# EAGLE design MotorController (EAGLE 7.4.0)
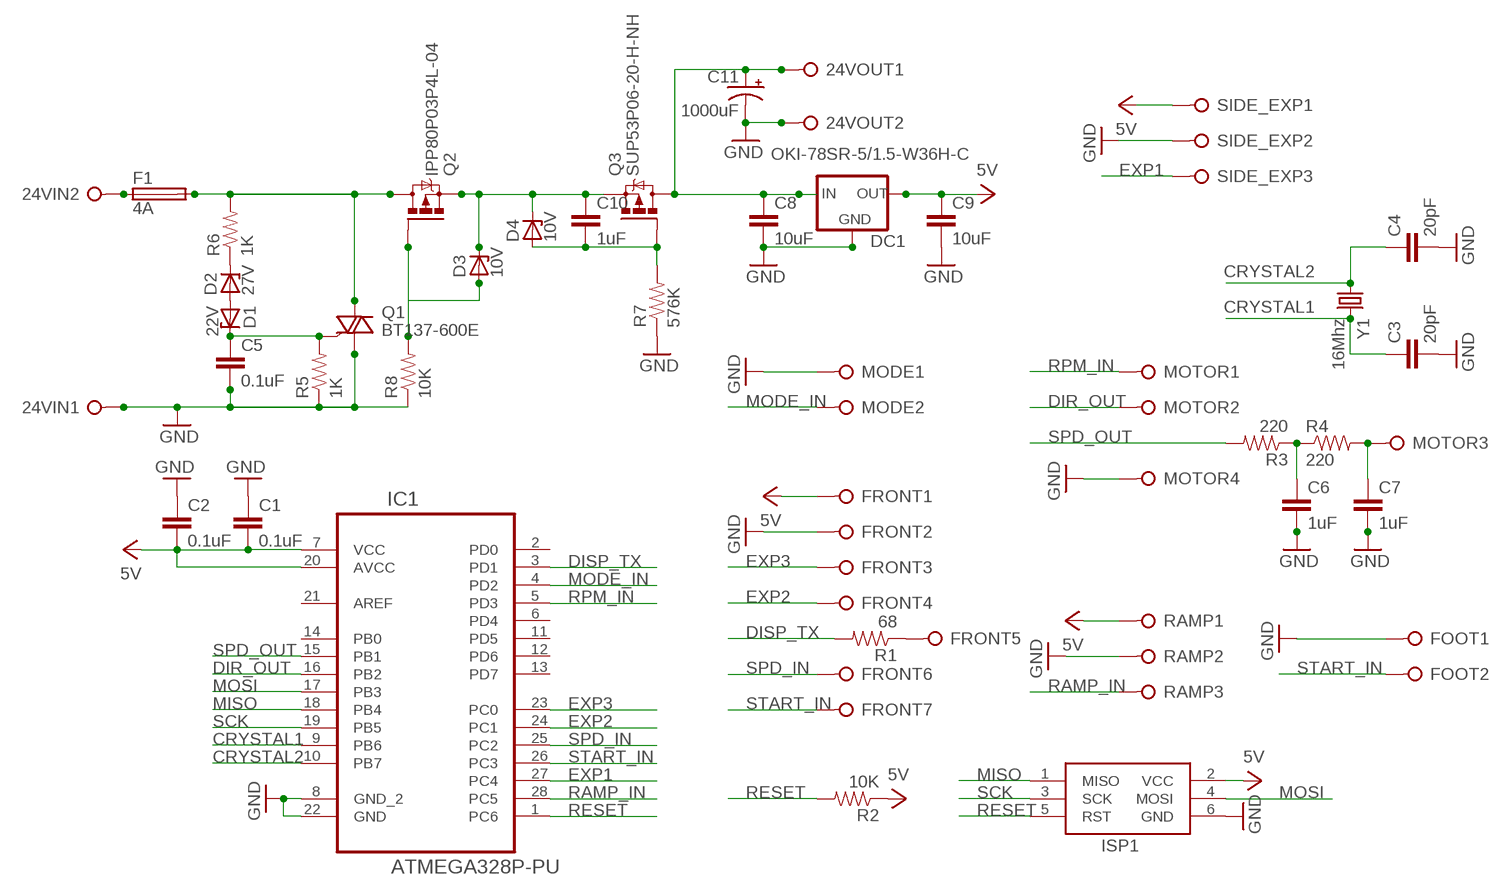
[diagram p0: schematic, sheet 1]

## Parts
24VIN  PINHD-1X2BIG  [1X02-BIG]
24VOUT  PINHD-1X2BIG  [1X02-BIG]
C1  0.1uF  CAPACITOR-2.5MM  [CAPACITOR-2.5MM]
C2  0.1uF  CAPACITOR-2.5MM  [CAPACITOR-2.5MM]
C3  20pF  CAPACITOR-2.5MM  [CAPACITOR-2.5MM]
C4  20pF  CAPACITOR-2.5MM  [CAPACITOR-2.5MM]
C5  0.1uF  CAPACITOR-2.5MM  [CAPACITOR-2.5MM]
C6  1uF  CAPACITOR-2.5MM  [CAPACITOR-2.5MM]
C7  1uF  CAPACITOR-2.5MM  [CAPACITOR-2.5MM]
C8  10uF  CAPACITOR-5MM  [CAPACITOR-5MM]
C9  10uF  CAPACITOR-5MM  [CAPACITOR-5MM]
C10  1uF  CAPACITOR-2.5MM  [CAPACITOR-2.5MM]
C11  1000uF  CAP-POL-25-14  [CAP-POL-25-14]
D1  22V  ZENER-7.5  [ZDIO-7.5]
D2  27V  ZENER-7.5  [ZDIO-7.5]
D3  10V  ZENER-7.5  [ZDIO-7.5]
D4  10V  ZENER-7.5  [ZDIO-7.5]
DC1  OKI-78SR-5/1.5-W36H-C  DC-CONV  [DC-CONV]
F1  4A  FUSE  [FUSE_HOLDER_5X20MM]
FOOT  PINHD-1X2BIG  [1X02-BIG]
FRONT  PINHD-1X7BIG  [1X07-BIG]
IC1  ATMEGA328P-PU  [DIP28]
ISP1  ICSP-HEADER-6  [ICSP-HEADER]
MODE  PINHD-1X2BIG  [1X02-BIG]
MOTOR  PINHD-1X4BIG  [1X04-BIG]
Q1  BT137-600E  TRIAC-H-NH  [TO220BH-NO-HOLE]
Q2  IPP80P03P4L-04  SUP53P06-20-H-NH  [TO220BH-NO-HOLE]
Q3  SUP53P06-20-H-NH  [TO220BH-NO-HOLE]
R1  68  RESISTOR-7.5MM  [AXIAL-7.5MM]
R2  10K  RESISTOR-7.5MM  [AXIAL-7.5MM]
R3  220  RESISTOR-7.5MM  [AXIAL-7.5MM]
R4  220  RESISTOR-7.5MM  [AXIAL-7.5MM]
R5  1K  RESISTOR-7.5MM  [AXIAL-7.5MM]
R6  1K  RESISTOR-7.5MM  [AXIAL-7.5MM]
R7  576K  RESISTOR-7.5MM  [AXIAL-7.5MM]
R8  10K  RESISTOR-7.5MM  [AXIAL-7.5MM]
RAMP  PINHD-1X3BIG  [1X03-BIG]
SIDE_EXP  PINHD-1X3BIG  [1X03-BIG]
Y1  16Mhz  CRYSTAL-V  [CRYSTAL-V]

## Nets
24V [power]: F1.2 Q1.P2(A2) Q2.P2(D) R6.P$2
24V-PROTECTED [power]: 24VOUT.1 C8.1 C11.+ DC1.P1(IN) Q3.P2(D)
CRYSTAL1: C3.1 IC1.9(PB6) Y1.2
CRYSTAL2: C4.1 IC1.10(PB7) Y1.1
DIR_OUT: IC1.16(PB2) MOTOR.2
DISP_TX: IC1.3(PD1) R1.P$2
EXP1: IC1.27(PC4) SIDE_EXP.3
EXP2: FRONT.4 IC1.24(PC1)
EXP3: FRONT.3 IC1.23(PC0)
GND: 24VIN.1 24VOUT.2 C1.1 C2.1 C3.2 C4.2 C5.2 C6.2 C7.2 C8.2 C9.2 C11.- DC1.P2(GND) FOOT.1 FRONT.2 IC1.8(GND_2) IC1.22(GND) ISP1.6(GND) MODE.1 MOTOR.4 Q1.P1(A1) R5.P$1 R7.P$1 R8.P$1 RAMP.2 SIDE_EXP.2
MISO: IC1.18(PB4) ISP1.1(MISO)
MODE_IN: IC1.4(PD2) MODE.2
MOSI: IC1.17(PB3) ISP1.4(MOSI)
N$1: C6.1 R3.P$1 R4.P$1
N$3: 24VIN.2 F1.1
N$4: D3.A Q2.P1(G) R8.P$2
N$5: D2.C R6.P$1
N$6: D1.A D2.A
N$7: C5.1 D1.C Q1.P3(G) R5.P$2
N$8: FRONT.5 R1.P$1
N$9 [power]: C10.1 D3.C D4.C Q2.P3(S) Q3.P3(S)
N$10: C7.1 MOTOR.3 R4.P$2
N$11: C10.2 D4.A Q3.P1(G) R7.P$2
RAMP_IN: IC1.28(PC5) RAMP.3
RESET: IC1.1(PC6) ISP1.5(RST) R2.P$2
RPM_IN: IC1.5(PD3) MOTOR.1
SCK: IC1.19(PB5) ISP1.3(SCK)
SPD_IN: FRONT.6 IC1.25(PC2)
SPD_OUT: IC1.15(PB1) R3.P$2
START_IN: FOOT.2 FRONT.7 IC1.26(PC3)
VCC: C1.2 C2.2 C9.1 DC1.P3(OUT) FRONT.1 IC1.7(VCC) IC1.20(AVCC) ISP1.2(VCC) R2.P$1 RAMP.1 SIDE_EXP.1 ; supply symbol labelled 5V
Unconnected: IC1.2(PD0) IC1.6(PD4) IC1.11(PD5) IC1.12(PD6) IC1.13(PD7) IC1.14(PB0) IC1.21(AREF)

## Library data of the parts
24VIN 24VOUT FOOT MODE = SaintGimp:PINHD-1X2
C1-C10 = SaintGimp:CAPACITOR-*: Ceramic Capacitor
C11 = SaintGimp:CAP-POL: Polarized Capacitor
D1-D4 = SaintGimp:ZENER: Zener Diode
DC1 = SaintGimp:DC-CONV: DC-DC Converter
F1 = SaintGimp:FUSE
FRONT = SaintGimp:PINHD-1X7
IC1 = SaintGimp:ATMEGA328P-PU: 8-bit Microcontroller with In-System Programmable Flash; MPN: ATMEGA328P-PU; OC_FARNELL: 1715487; OC_NEWARK: 15R0268; PACKAGE: PDIP-28; SUPPLIER: Atmel
ISP1 = SaintGimp:ICSP-HEADER: ICSP HEADER Standard 6 pin header for ICSP programming
MOTOR = SaintGimp:PINHD-1X4
Q1 = SaintGimp:TRIAC: TRIAC
Q2 Q3 = SaintGimp:SUP53P06-20: P-Channel MOSFET
R1-R8 = SaintGimp:RESISTOR-*
RAMP SIDE_EXP = SaintGimp:PINHD-1X3: PIN HEADER
Y1 = SaintGimp:CRYSTAL: Crystal Oscillator

## Net classes
1 power: width 0.381 mm

## Board
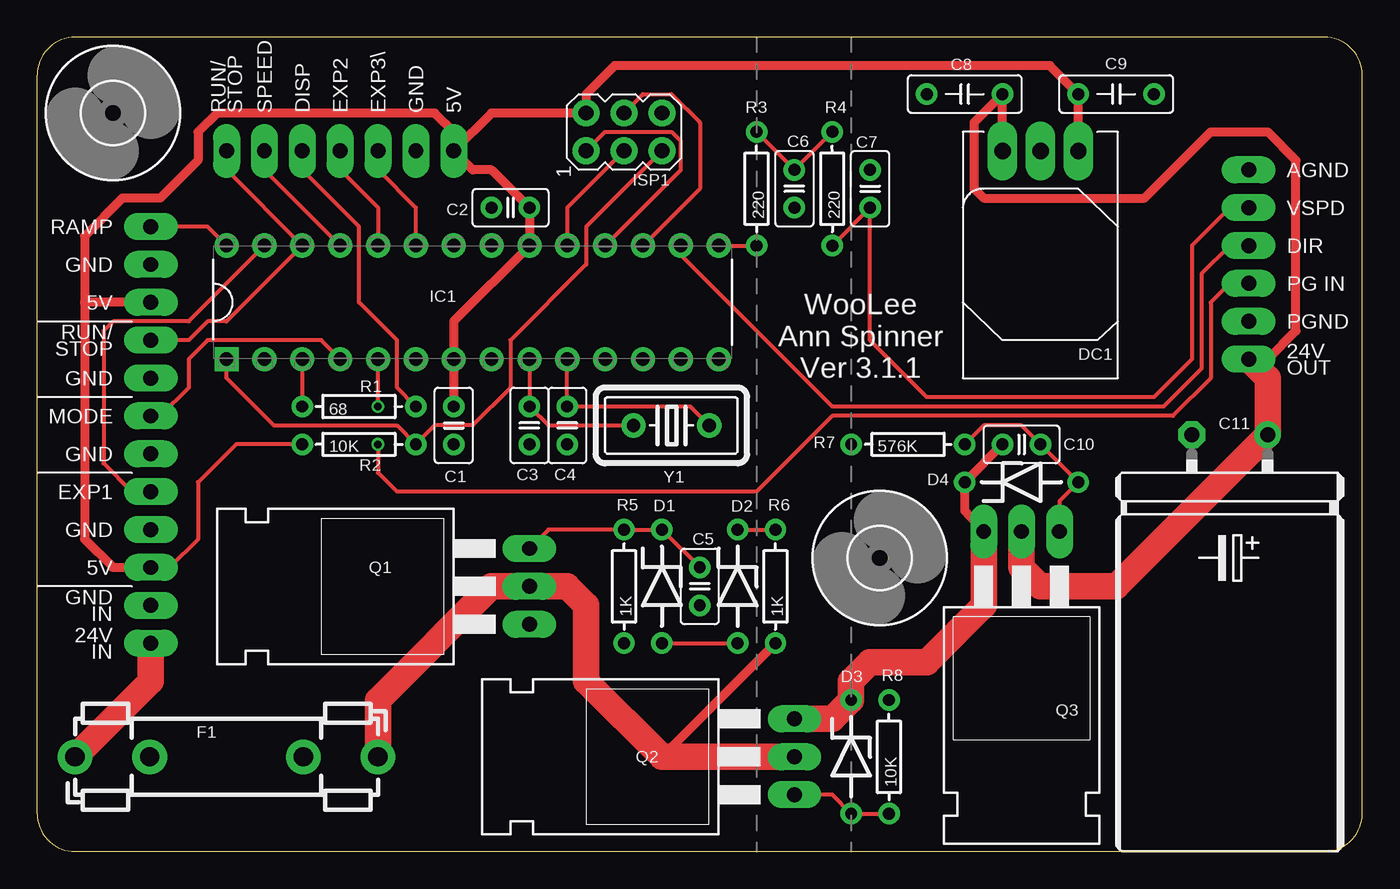
[diagram p1: board, top side]
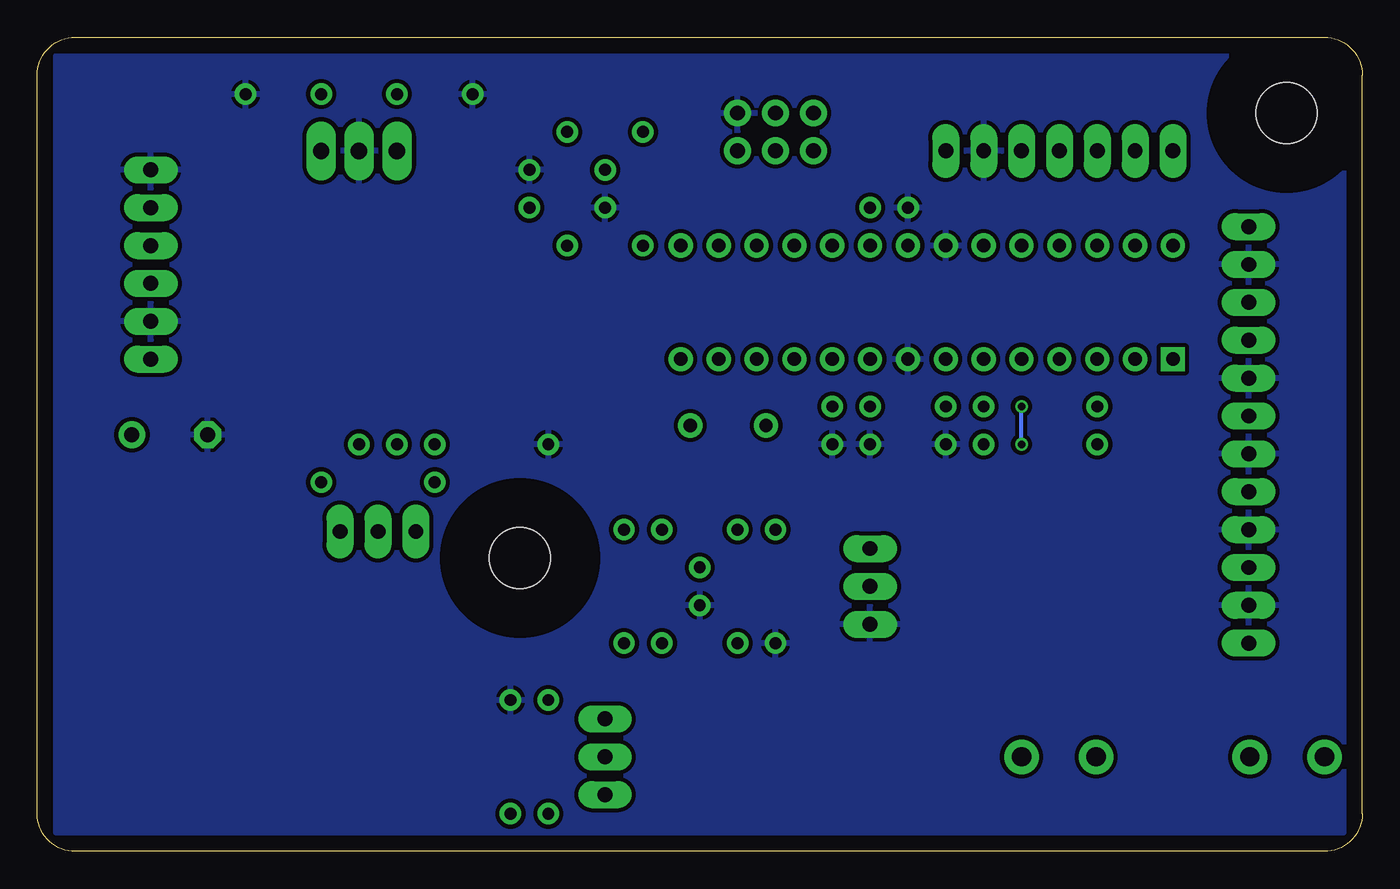
[diagram p2: board, bottom side, seen from below]

Size 88.9 x 54.61 mm. Coordinates in mm from the lower left corner, seen from the top.
Outline: 0,2.54 arc90 2.54,0 86.36,0 arc90 88.9,2.54 88.9,52.07 arc90 86.36,54.61 2.54,54.61 arc90 0,52.07 0,2.54
Copper layers (1*16): Top 0.0356mm / dielectric 1.5011mm / Bottom 0.0356mm
Design rules "Saintgimp-OSHPark": minimum track width 10mil, minimum drill 13mil, track to track 6mil, track to pad 6mil, pad to pad 6mil, via to via 6mil, smd to smd 6mil, copper to edge 15mil, drill to drill 6mil, minimum pad ring 12mil, minimum via ring 7mil, stop-mask expansion 2mil, vias tented up to drill 20mil, thermal gap 10mil

### Footprints (pad centres in the part's own frame; a part is rotated, then mirrored left to right if it is on the bottom)
1X02-BIG = drill 1 long: 1 -1.27,0; 2 1.27,0
CAPACITOR-2.5MM = drill 0.8: 1 -1.27,0; 2 1.27,0
CAPACITOR-5MM = drill 0.8: 1 -2.54,0; 2 2.54,0
CAP-POL-25-14 = drill 1: + -17.78,2.54 | drill 1 octagon: - -17.78,-2.54
ZDIO-7.5 = drill 0.8: A 3.81,0; C -3.81,0
DC-CONV = drill 1.1 long: P1 2.54,-7.62; P2 0,-7.62; P3 -2.54,-7.62
FUSE_HOLDER_5X20MM = drill 1.3: 1 -10.16,0; 2 10.16,0; 3 -5.156,0; 5 5.156,0
1X07-BIG = drill 1 long: 1 -7.62,0; 2 -5.08,0; 3 -2.54,0; 4 0,0; 5 2.54,0; 6 5.08,0; 7 7.62,0
DIP28 = drill 0.9 square: 1 -7.62,33.02 | drill 0.9: 2 -7.62,30.48; 3 -7.62,27.94; 4 -7.62,25.4; 5 -7.62,22.86; 6 -7.62,20.32; 7 -7.62,17.78; 8 -7.62,15.24; 9 -7.62,12.7; 10 -7.62,10.16; 11 -7.62,7.62; 12 -7.62,5.08; 13 -7.62,2.54; 14 -7.62,0; 15 0,0; 16 0,2.54; 17 0,5.08; 18 0,7.62; 19 0,10.16; 20 0,12.7; 21 0,15.24; 22 0,17.78; 23 0,20.32; 24 0,22.86; 25 0,25.4; 26 0,27.94; 27 0,30.48; 28 0,33.02
ICSP-HEADER = drill 1: 1 -1.27,2.54; 2 1.27,2.54; 3 -1.27,0; 4 1.27,0; 5 -1.27,-2.54; 6 1.27,-2.54
1X04-BIG = drill 1 long: 1 -3.81,0; 2 -1.27,0; 3 1.27,0; 4 3.81,0
TO220BH-NO-HOLE = drill 1 long: P1 -2.54,-6.35; P2 0,-6.35; P3 2.54,-6.35
AXIAL-7.5MM = drill 0.8: P$1 -3.81,0; P$2 3.81,0
1X03-BIG = drill 1 long: 1 -2.54,0; 2 0,0; 3 2.54,0
4,1 = hole 4.1: 0,0
CRYSTAL-V = drill 0.9: 1 -2.54,0; 2 2.54,0

### Placement (x,y rotation side)
24VIN  7.62,15.24 270 top
24VOUT  81.28,34.29 90 top
C1  27.94,28.57 90 top
C2  31.75,43.18 0 top
C3  33.02,28.57 270 top
C4  35.56,28.57 270 top
C5  44.45,17.78 270 top
C6  50.8,44.45 270 top
C7  55.88,44.45 90 top
C8  62.23,50.8 180 top
C9  72.39,50.8 0 top
C10  66.04,27.3 0 top
C11  80.01,10.16 270 top
D1  41.91,17.78 270 top
D2  46.99,17.78 270 top
D3  54.61,6.35 270 top
D4  66.04,24.77 0 top
DC1  67.31,39.37 180 top
F1  12.7,6.35 0 top
FOOT  7.62,33.02 90 top
FRONT  20.32,46.99 180 top
IC1  45.72,40.64 90 top
ISP1  39.37,48.26 90 top
MODE  7.62,27.94 90 top
MOTOR  81.28,41.91 90 top
Q1  26.67,17.78 90 top
Q2  44.45,6.35 90 top
Q3  66.04,15.11 180 top
R1  21.59,29.84 180 top
R2  21.59,27.3 0 top
R3  48.26,44.45 270 top
R4  53.34,44.45 270 top
R5  39.37,17.78 90 top
R6  49.53,17.78 270 top
R7  58.42,27.3 0 top
R8  57.15,6.35 270 top
RAMP  7.62,39.37 90 top
SIDE_EXP  7.62,21.59 90 top
U$2  [4,1]  5.08,49.53 0 top
U$4  [4,1]  56.52,19.68 0 top
Y1  42.55,28.57 180 top

### Tracks (layer width: path | path; a pad name or v marks a point on that pad's centre or on a via)
24V
  Top 0.61: R6.P$2 41.91,6.35
  Top 1.778: Q2.P2 41.91,6.35 36.83,11.43 36.83,16.51 35.56,17.78 Q1.P2 30.48,17.78 22.86,10.16 F1.2
24V-PROTECTED
  Top 0.61: 24VOUT.1 82.55,33.02 84.45,34.92 84.45,46.35 82.55,48.26 78.74,48.26 74.3,43.81 63.5,43.81 62.87,44.45 62.87,48.9 C8.1 DC1.P1
  Top 1.778: Q3.P2 66.04,19.05 67.31,17.78 72.39,17.78 C11.+ 82.55,31.75 24VOUT.1
CRYSTAL1
  Top 0.254: Y1.2 34.29,28.57 C3.1 IC1.9
CRYSTAL2
  Top 0.254: Y1.1 43.81,29.84 C4.1 IC1.10
DIR_OUT
  Top 0.254: MOTOR.2 80.01,40.64 78.11,38.73 78.11,32.38 75.56,29.84 53.34,29.84 43.18,40.01 IC1.16
DISP_TX
  Top 0.254: IC1.3 R1.P$2
EXP1
  Top 0.254: IC1.27 10.16,35.56 5.08,35.56 4.45,34.92 4.45,26.04 6.35,24.13 SIDE_EXP.3
EXP2
  Top 0.254: FRONT.4 20.32,45.72 22.86,43.18 IC1.24
EXP3
  Top 0.254: FRONT.3 22.86,45.72 25.4,43.18 IC1.23
GND
  pour Bottom (isolate 0.279): 1.27,53.34 1.27,1.27 87.63,1.27 87.63,53.34
MISO
  Top 0.254: ISP1.1 38.1,48.26 42.55,48.26 43.18,47.62 43.18,45.72 IC1.18
MODE_IN
  Top 0.254: IC1.4 19.05,34.29 11.43,34.29 10.16,33.02 10.16,31.11 8.26,29.21 MODE.2
MOSI
  Top 0.254: ISP1.4 40.64,50.8 42.55,50.8 44.45,48.9 44.45,44.45 IC1.17
N$1
  Top 0.254: R3.P$1 C6.1 R4.P$1
N$3
  Top 1.778: F1.1 7.62,11.43 24VIN.2
N$4
  Top 0.254: R8.P$2 D3.A 53.34,3.81 Q2.P1
N$5
  Top 0.254: D2.C R6.P$1
N$6
  Top 0.254: D1.A D2.A
N$7
  Top 0.254: C5.1 D1.C R5.P$2 34.29,21.59 Q1.P3
N$8
  Top 0.254: R1.P$1 24.13,31.11 24.13,34.29 21.59,36.83 21.59,41.91 17.78,45.72 FRONT.5
N$9
  Top 0.61: Q3.P3 62.23,22.86 D4.C C10.1
  Top 1.778: Q3.P3 63.5,16.51 59.69,12.7 55.88,12.7 54.61,11.43 D3.C 53.34,8.89 Q2.P3
N$10
  Top 0.254: R4.P$2 C7.1 55.88,34.29 59.69,30.48 74.93,30.48 77.47,33.02 77.47,40.64 80.01,43.18 MOTOR.3
N$11
  Top 0.254: Q3.P1 68.58,23.5 D4.A C10.2 66.04,28.57 63.5,28.57 R7.P$2
RAMP_IN
  Top 0.254: IC1.28 11.43,41.91 RAMP.3
RESET
  Top 0.254: IC1.1 12.7,31.75 15.88,28.57 24.13,28.57 R2.P$2 26.67,28.57 29.21,28.57 31.75,31.11 31.75,34.29 36.83,39.37 36.83,41.91 40.64,45.72 ISP1.5
RPM_IN  (via drill 0.5)
  Top 0.254: MOTOR.1 80.01,38.1 78.74,36.83 78.74,31.75 76.2,29.21 53.34,29.21 48.26,24.13 24.13,24.13 22.86,25.4 v22.86,27.3 | v22.86,29.84 IC1.5
  Bottom 0.254: v22.86,27.3 v22.86,29.84
SCK
  Top 0.254: ISP1.3 35.56,43.18 IC1.19
SPD_IN
  Top 0.254: FRONT.6 15.24,45.72 IC1.25
SPD_OUT
  Top 0.254: IC1.15 R3.P$2
START_IN
  Top 0.254: FOOT.2 10.16,34.29 11.43,35.56 12.7,35.56 IC1.26 12.7,45.72 FRONT.7
VCC
  Top 0.254: SIDE_EXP.1 8.89,19.05 10.79,20.95 10.79,24.77 13.34,27.3 R2.P$1
  Top 0.61: C1.2 IC1.7 27.94,35.56 IC1.20 C2.2 30.48,45.72 29.21,45.72 FRONT.1 | 3.17,36.83 3.17,41.27 5.71,43.81 8.26,43.81 10.79,46.35 10.79,48.26 12.06,49.53 26.67,49.53 27.94,48.26 FRONT.1 | 3.17,36.83 3.17,20.95 5.08,19.05 SIDE_EXP.1 | RAMP.1 3.17,36.83 | FRONT.1 30.48,49.53 ISP1.2 36.83,50.8 38.73,52.7 67.94,52.7 C9.1 DC1.P3

### Text on the board
_tsilk: RUN/ / STOP | SPEED | DISP | EXP2 | EXP3\ | GND | 5V | AGND | VSPD | RAMP | DIR | GND | PG IN | 5V | PGND | RUN/ / STOP | 24V / OUT | GND | WooLee / Ann Spinner / Ver 3.1.1 | MODE | GND | EXP1 | GND | 5V | GND / IN | 24V / IN